# Altium schematic sheet 0_Architecture.SchDoc: IIP Hardware Architecture
size A4; Address5: CEP: 88040 - 900; Organization: UFSC; DocumentNumber: 1; SheetNumber: 1; SheetTotal: 2; ProjectCode: IIP
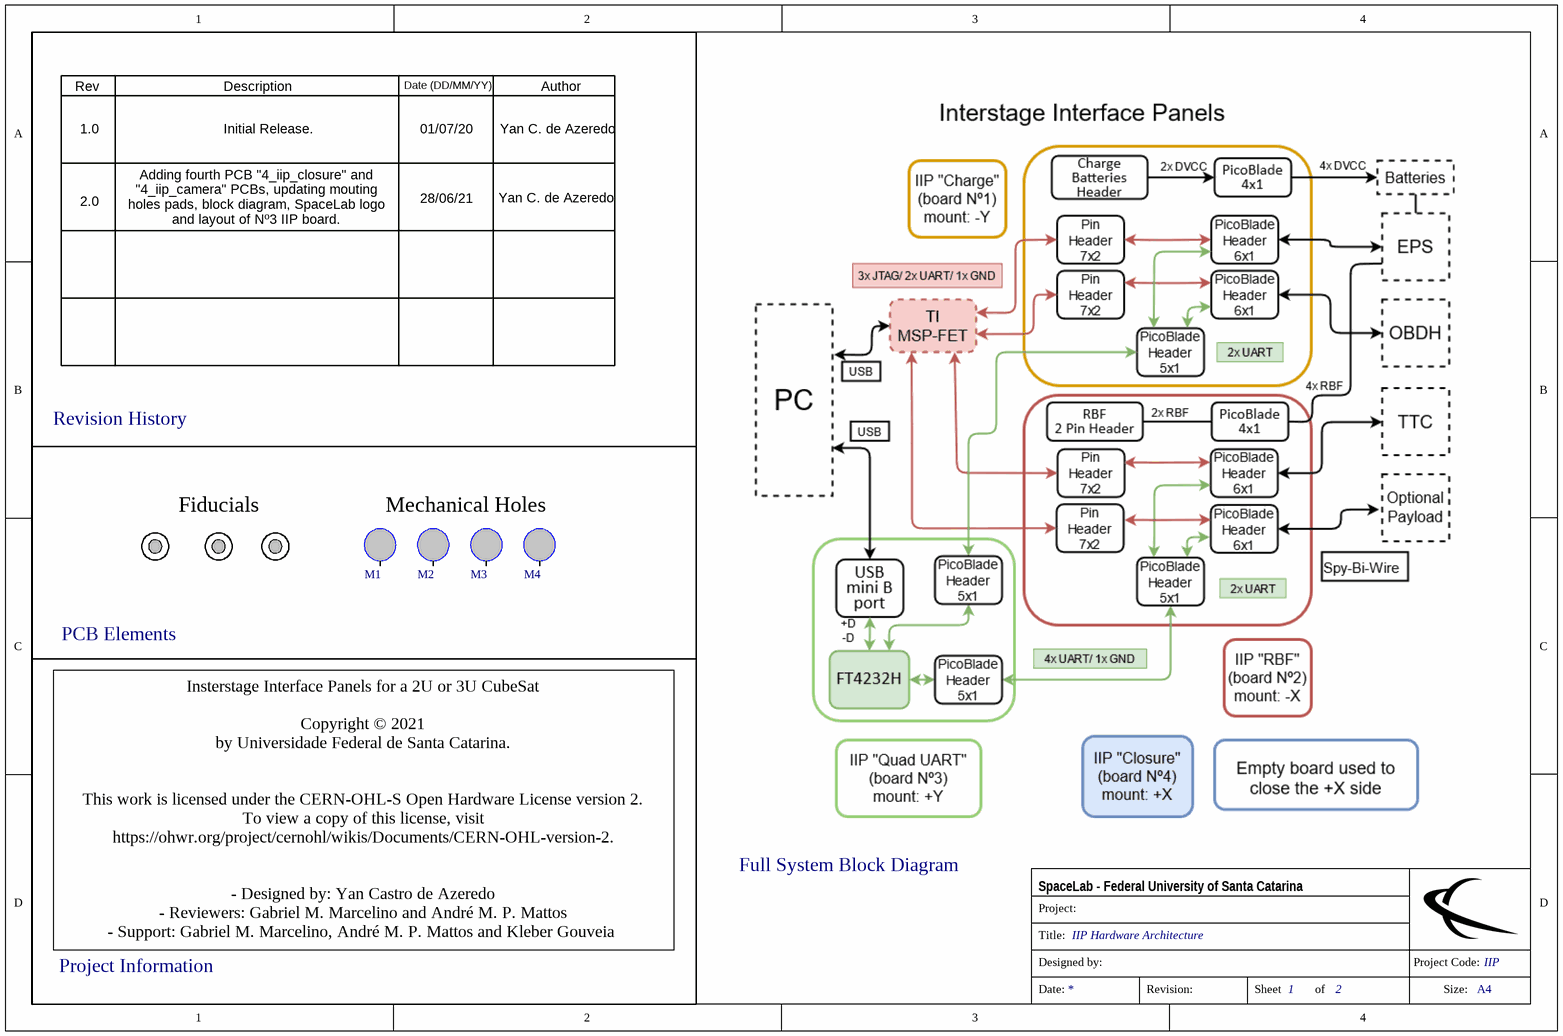
[diagram p0: 0_Architecture.SchDoc]

## Parts
FD1  Fiducial 1.3  [Fiducial 1.3mm]  (value not drawn)  (no BOM)
FD2  Fiducial 1.3  [Fiducial 1.3mm]  (value not drawn)  (no BOM)
FD3  Fiducial 1.3  [Fiducial 1.3mm]  (value not drawn)  (no BOM)
M1  IB Mechanical Hole  [M3 hole (5.5mm pad)]  (value not drawn)  (no BOM)
M2  IB Mechanical Hole  [M3 hole (5.5mm pad)]  (value not drawn)  (no BOM)
M3  IB Mechanical Hole  [M3 hole (5.5mm pad)]  (value not drawn)  (no BOM)
M4  IB Mechanical Hole  [M3 hole (5.5mm pad)]  (value not drawn)  (no BOM)

## Nets

Not connected (* = marked no-connect by the designer): M1 0; M2 0; M3 0; M4 0

## Notes on the sheet
- Rev
- Description
- Date (DD/MM/YY)
- Author
- 1.0
- Initial Release.
- 01/07/20
- Yan C. de Azeredo
- 2.0
- Adding fourth PCB "4_iip_closure" and "4_iip_camera" PCBs, updating mouting holes pads, block diagram, SpaceLab logo and layout of Nº3 IIP board.
- 28/06/21
- Revision History
- Fiducials
- Mechanical Holes
- PCB Elements
- Full System Block Diagram
- Insterstage Interface Panels for a 2U or 3U CubeSat
  Copyright © 2021
  by Universidade Federal de Santa Catarina.
  This work is licensed under the CERN-OHL-S Open Hardware License version 2.
  To view a copy of this license, visit https://ohwr.org/project/cernohl/wikis/Documents/CERN-OHL-version-2.
  - Designed by: Yan Castro de Azeredo
  - Reviewers: Gabriel M. Marcelino and André M. P. Mattos
  - Support: Gabriel M. Marcelino, André M. P. Mattos and Kleber Gouveia
  - Mechanical validation: Edemar M. Filho and Caique S. M. Gomes
- Project Information
- Project:
- SpaceLab - Federal University of Santa Catarina
- Title:
- Designed by:
- Project Code:
- Date:
- Revision:
- Sheet
- of
- Size:
- A4

## Library data of the parts
FD1-FD3 = Fiducial 1.3: Fiducial 1.3mm
M1-M4 = IB Mechanical Hole: Mechanical Hole for FloripaSat-2 interface boards